# Altium project Buzzer Circuit.PrjPcb
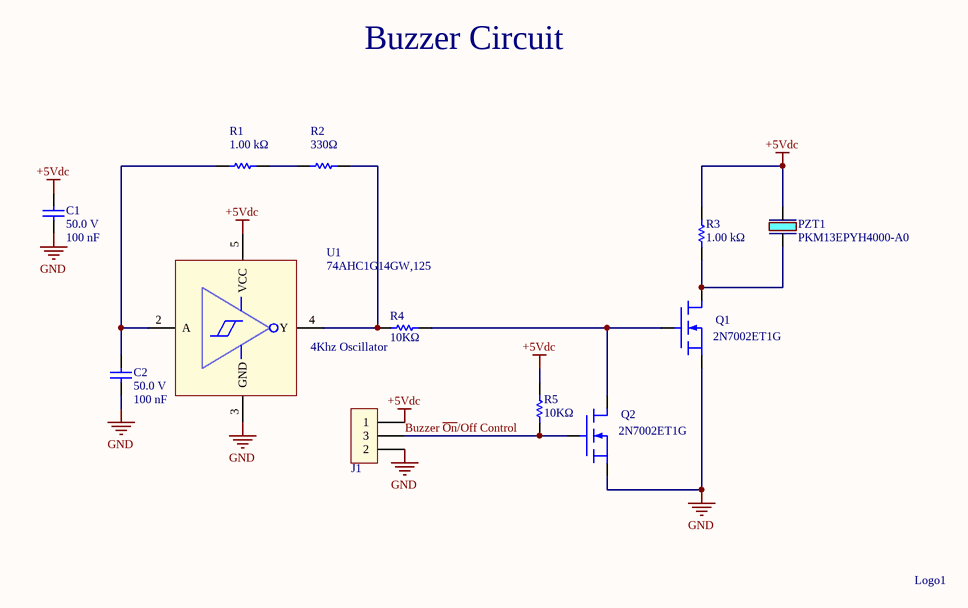
[diagram p0: Buzzer Circuit.SchDoc]
1 sheet, 13 parts. Net scope: global (net labels, ports and power ports of the same name join across sheets).

## Sheet Buzzer Circuit.SchDoc
size A

### Parts
C1  Voltage Rating (DC): 50.0 V  Capacitance: 100 nF  [Cap,0805]  (hidden comment: 08055C104JAT2A)
C2  Voltage Rating (DC): 50.0 V  Capacitance: 100 nF  [Cap,0805]  (hidden comment: 08055C104JAT2A)
J1  Generic Header  [Header,3POS,0.1",RA]  (value not drawn)
Logo1  Open Source Logo  [Symbol,Open Source]  (value not drawn)
PZT1  PKM13EPYH4000-A0  [Buzzer,PKM13EPYH4000-A0]
Q1  2N7002ET1G  [SOT23-3]
Q2  2N7002ET1G  [SOT23-3]
R1  Resistance: 1.00 kΩ  [res, 0805, HD]  (hidden comment: Vishay CRCW08051K00JNEA)
R2  Resistance: 330Ω  [res, 0805, HD]  (hidden comment: Res1)
R3  Resistance: 1.00 kΩ  [res, 0805, HD]  (hidden comment: Vishay CRCW08051K00JNEA)
R4  Resistance: 10KΩ  [res, 0805, HD]  (hidden comment: Vishay / Dale CRCW080510K0FKTA)
R5  Resistance: 10KΩ  [res, 0805, HD]  (hidden comment: Vishay / Dale CRCW080510K0FKTA)
U1  74AHC1G14GW,125  [SOT-353]

### Nets
+5Vdc: C1.2 J1.1 PZT1.2 R3.1 R5.1 U1.5(VCC)
GND: C1.1 C2.2 J1.2 Q1.2(S) Q2.2(S) U1.3(GND)
Buzzer ~{On}/Off Control: J1.3 Q2.1(G) R5.2
NetC2_1: C2.1 R1.1 U1.2(A)
NetPZT1_1: PZT1.1 Q1.3(D) R3.2
NetQ1_1: Q1.1(G) Q2.3(D) R4.1
NetR1_2: R1.2 R2.2
NetR2_1: R2.1 R4.2 U1.4(Y)

Not connected (* = marked no-connect by the designer): U1 1(N/C)

### Notes on the sheet
- Buzzer Circuit
- 4Khz Oscillator

### Library data of the parts
C1 C2 = Cap,0805,100nf,50V,5%,08055C104JAT2A: Capacitor; Ceramic; Cap 0.1 uF; Tol 5%; Vol-Rtg 50 VDC; SMT; 0805; X7R; Tape & Reel; Lead-Free Status: Lead Free; Case/Package (SI): 2012; Insulation Resistance: 100 GΩ; Detailed Description: 0.1µF ±5% 50V Ceramic Capacitor X7R 0805 (2012 Metric); Mounting Style: Surface Mount; Packaging: Tape & Reel (TR), Cut Tape (CT); RoHS: Compliant; Size-Width: 1.24 mm; Case/Package: 0805; Number of Pins: 2; digikey url: http://www.digikey.ca/product-detail/en/avx-corporation/08055C104JAT2A/478-3352-1-ND/930144; REACH SVHC Compliance: No SVHC; Dielectric Characteristic: X7R; Capacitance Tolerance: ±5%; Size-Length: 2.01 mm; Size-Height: 710 µm; Size-Thickness: 940 µm; Manufacturer Part Number: 08055C104JAT2A; Octopart URL: http://octopart.com/08055c104jat2a-avx-55388010; Operating Temperature: -55°C ~ 125°C; Supplier 1: Digi-Key; Supplier Part Number 1: 478-3352-1-ND
J1 = Header 1x3,0.1",TH,Generic: Generic Header 3 pos header 0.1"
Logo1 = Symbol,Open Source: Open Source Silk Screen Logo
PZT1 = Buzzer,PIEZO,30V,TH,4Khz,PKM13EPYH4000-A0: AUDIO PIEZO TRANSDUCER 30V TH; Manufacturer: Murata Electronics; Detailed Description: Buzzers Transducer, Externally Driven Piezo 1.5 V - 4kHz 70dB @ 1.5V, 10cm Through Hole PC Pins; Driver Circuitry: Transducer, Externally Driven; Input Type: Zero-Peak Signal; Voltage Range: 30V (Max); Frequency: 4kHz; Operating Mode: Ringer; Sound Pressure Level (SPL): 70dB @ 1.5V, 10cm; Port Location: Top; Voltage - Rated: 1.5 V; mfg P/N: PKM13EPYH4000-A0; Category: Audio Products  Alarms, Buzzers, and Sirens; Series: PK; Part Status: Active; Technology: Piezo; Operating Temperature: -40°C ~ 85°C; Mounting Type: Through Hole; Termination: PC Pins; Size / Dimension: 0.496" Dia (12.60mm); Height - Seated (Max): 0.291" (7.40mm); Base Product Number: PKM13EPY; Supplier 1: Mouser; Supplier Part Number 1: 81-PKM13EPYH4000-A0; Supplier 2: Arrow Electronics; Supplier Part Number 2: PKM13EPYH4000-A0; Supplier 3: Digi-Key; Supplier Part Number 3: 490-4698-1-ND
Q1 Q2 = MOSFET,N-Channel,SOT23,0.25A,60V,2N7002ET1G: Small Signal MOSFET, 60 V, 310 mA, Single, N-Channel, 3-Pin SOT-23, Pb-Free, Tape and Reel; Manufacturer: ON Semiconductor; Continuous Drain Current (Ids): 0.25A; Lead-Free Status: Lead Free; Drain to Source Voltage (Vds): 60.0 V; Power Dissipation (Max): 350mW (Ta); REACH SVHC Compliance: No SVHC; Number of Pins: 3; Halogen Free Status: Halogen Free; Case/Package: SOT-23-3; Polarity: N-Channel; RoHS: Compliant; Lifecycle Status: Active; Supplier 1: Digi-Key; Supplier Part Number 1: 2N7002ET1GOSCT-ND; Supplier 2: LCSC; Supplier Part Number 2: C71533; Manufacturer Part Number: 2N7002ET1G
R1 R3 = Res,0805,1.00 kΩ,5%,200ppm,CRCW08051K00JNEA: Res Thick Film 0805 1K Ohm 5% 0.125W(1/8W) ±200ppm/C Molded SMD Automotive Paper T/R; Power Rating: 125 mW; Case/Package (SI): 2012; Lead-Free Status: Lead Free; Temperature Coefficient: 200 ppm/°C; Voltage Rating (DC): 150 V; Size-Width: 1.25 mm; Mounting Style: Surface Mount; REACH SVHC Compliance: No SVHC; Manufacturer Part Number: CRCW08051K00JNEA; Number of Pins: 2; Size-Height: 450 µm; Packaging: Tape & Reel (TR), Cut Tape (CT); RoHS: Compliant; Resistance Tolerance: ±5%; Case/Package: 0805; Size-Length: 2.00 mm; Supplier 1: Digi-Key; Supplier Part Number 1: 541-1.0KADKR-ND; Supplier 2: Digi-Key; Supplier Part Number 2: 541-1.0KACT-ND
R2 = Res,0805,Generic: PPM: *; Wattage: *
R4 R5 = Res,0805,10.0kΩ,1%,100 ppm,CRCW080510K0FKTA: RES SMD 10K OHM 1% 1/8W 0805; Temperature Coefficient: 100.0 ppm/C; Lead-Free Status: Contains Lead; Voltage Rating (DC): 150.0 V; Power Rating: 0.125 W; Case/Package (SI): 2012; Size-Width: 0.00125 m; Resistance Tolerance: 1%; Size-Length: 0.002 m; RoHS: Non-Compliant; Power Dissipation: 0.125 W; Number of Pins: 2; REACH SVHC Compliance: No SVHC; Size-Height: 0.00045 m; Case/Package: 0805; Mounting Style: Surface Mount; Supplier 1: Digi-Key; Supplier Part Number 1: 541-3016-1-ND
U1 = IC,Logic,Schmitt trigger INV,2V ~ 5.5V,5-TSSOP , 74AHC1G14GW,125: IC INVERTER SCHMITT 1CH 5TSSOP; Manufacturer: Nexperia USA Inc.; Detailed Description: Inverter IC 1 Channel Schmitt Trigger 5-TSSOP; Number of Inputs: 1; Current - Output High, Low: 8mA, 8mA; Logic Level - Low: 0.9V ~ 1.65V; Logic Level - High: 2.2V ~ 3.85V; Max Propagation Delay @ V, Max CL: 10.6ns @ 5V, 50pF; Current - Quiescent (Max): 1µA; mfg P/N: 74AHC1G14GW,125; Category: Integrated Circuits (ICs)  Logic - Gates and Inverters; Series: 74AHC; Part Status: Active; Logic Type: Inverter; Features: Schmitt Trigger; Voltage - Supply: 2V ~ 5.5V; Operating Temperature: -40°C ~ 125°C; Mounting Type: Surface Mount; Supplier Device Package: 5-TSSOP; Package / Case: 5-TSSOP, SC-70-5, SOT-353; Number of Circuits: 1; Supplier 1: Digi-Key; Supplier Part Number 1: 1727-3149-1-ND; Supplier 2: LCSC; Supplier Part Number 2: C282410